# EAGLE schematic DashDial (EAGLE 9.6.2)
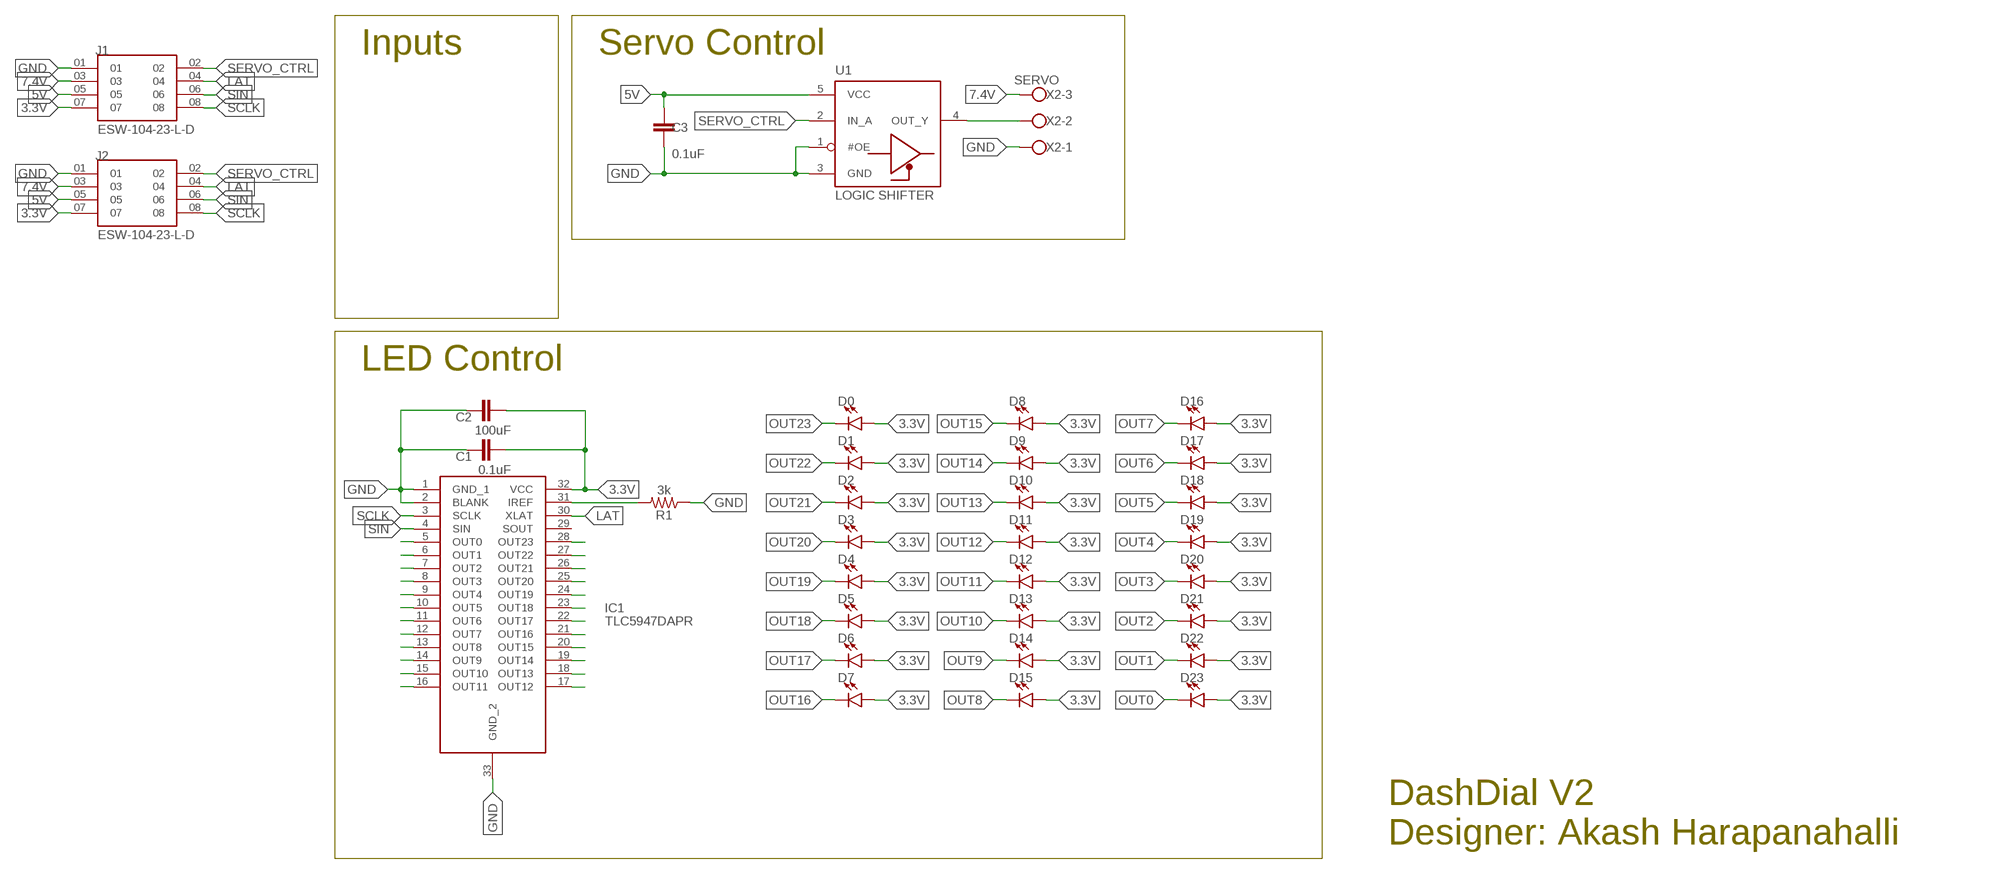
[diagram p0: schematic, sheet 1]

## Parts
C1  0.1uF  C-EUC0402  [C0402]
C2  100uF  C-EUC1206  [C1206]
C3  0.1uF  0.1UF-0603-25V-(+80/-20%)  [0603]
D0  LED3MM  [LED_3MM]
D1  LED3MM  [LED_3MM]
D2  LED3MM  [LED_3MM]
D3  LED3MM  [LED_3MM]
D4  LED3MM  [LED_3MM]
D5  LED3MM  [LED_3MM]
D6  LED3MM  [LED_3MM]
D7  LED3MM  [LED_3MM]
D8  LED3MM  [LED_3MM]
D9  LED3MM  [LED_3MM]
D10  LED3MM  [LED_3MM]
D11  LED3MM  [LED_3MM]
D12  LED3MM  [LED_3MM]
D13  LED3MM  [LED_3MM]
D14  LED3MM  [LED_3MM]
D15  LED3MM  [LED_3MM]
D16  LED3MM  [LED_3MM]
D17  LED3MM  [LED_3MM]
D18  LED3MM  [LED_3MM]
D19  LED3MM  [LED_3MM]
D20  LED3MM  [LED_3MM]
D21  LED3MM  [LED_3MM]
D22  LED3MM  [LED_3MM]
D23  LED3MM  [LED_3MM]
IC1  TLC5947DAPR  [SOP65P810X120-33N]
J1  ESW-104-23-L-D  [SAMTEC_ESW-104-23-L-D]
J2  ESW-104-23-L-D  [SAMTEC_ESW-104-23-L-D]
R1  3k  RESISTORAXIAL-0.3  [AXIAL-0.3]
U1  LOGIC SHIFTER  MC74VHC1GT125DF  [SOT353]
X2  SERVO  W237-103  [W237-103]

## Nets
3.3V: C1.2 C2.2 D0.A D1.A D2.A D3.A D4.A D5.A D6.A D7.A D8.A D9.A D10.A D11.A D12.A D13.A D14.A D15.A D16.A D17.A D18.A D19.A D20.A D21.A D22.A D23.A IC1.32(VCC) J1.07 J2.07
5V: C3.1 J1.05 J2.05 U1.5(VCC)
7.4V: J1.03 J2.03 X2.3
GND: C1.1 C2.1 C3.2 IC1.1(GND_1) IC1.2(BLANK) IC1.33(GND_2) J1.01 J2.01 R1.P$1 U1.1(#OE) U1.3(GND) X2.1
LAT: IC1.30(XLAT) J1.04 J2.04
N$1: U1.4(OUT_Y) X2.2
N$32: IC1.31(IREF) R1.P$2
OUT0: D23.K(C) IC1.5(OUT0)
OUT1: D22.K(C) IC1.6(OUT1)
OUT2: D21.K(C) IC1.7(OUT2)
OUT3: D20.K(C) IC1.8(OUT3)
OUT4: D19.K(C) IC1.9(OUT4)
OUT5: D18.K(C) IC1.10(OUT5)
OUT6: D17.K(C) IC1.11(OUT6)
OUT7: D16.K(C) IC1.12(OUT7)
OUT8: D15.K(C) IC1.13(OUT8)
OUT9: D14.K(C) IC1.14(OUT9)
OUT10: D13.K(C) IC1.15(OUT10)
OUT11: D12.K(C) IC1.16(OUT11)
OUT12: D11.K(C) IC1.17(OUT12)
OUT13: D10.K(C) IC1.18(OUT13)
OUT14: D9.K(C) IC1.19(OUT14)
OUT15: D8.K(C) IC1.20(OUT15)
OUT16: D7.K(C) IC1.21(OUT16)
OUT17: D6.K(C) IC1.22(OUT17)
OUT18: D5.K(C) IC1.23(OUT18)
OUT19: D4.K(C) IC1.24(OUT19)
OUT20: D3.K(C) IC1.25(OUT20)
OUT21: D2.K(C) IC1.26(OUT21)
OUT22: D1.K(C) IC1.27(OUT22)
OUT23: D0.K(C) IC1.28(OUT23)
SCLK: IC1.3(SCLK) J1.08 J2.08
SERVO_CTRL: J1.02 J2.02 U1.2(IN_A)
SIN: IC1.4(SIN) J1.06 J2.06
Unconnected: IC1.29(SOUT)

## Notes on the sheet
- Inputs | Servo Control
- LED Control
- DashDial V2
  Designer: Akash Harapanahalli

## Library data of the parts
C1 C2 = rcl:C-EU: CAPACITOR, European symbol; SPICEPREFIX: C
C3 = SparkFun-Capacitors:0.1UF: 0.1µF ceramic capacitors A capacitor is a passive two-terminal electrical component used to store electrical energy temporarily in an electric field.; PROD_ID: CAP-00810
D0 D1-D23 = SparkFun-LED:LED: LED (Generic) Standard schematic elements and footprints for 5mm, 3mm, 1206, and 0603 sized LEDs. Generic LEDs with no color specified.; PROD_ID: DIO-08794
IC1 = TLC5947DAPR:TLC5947DAPR: 24-Channel, 12-Bit PWM LED Driver with Internal Oscillator Source: Datasheet <https://www.arrow.com/en/products/tlc5947dapr/texas-instruments>; ARROW_PART_NUMBER: TLC5947DAPR; ARROW_PRICE-STOCK: https://www.arrow.com/en/products/tlc5947dapr/texas-instruments; DESCRIPTION: 24-Channel, 12-Bit PWM LED Driver with Internal Oscillator; HEIGHT: 1.2mm; MANUFACTURER_NAME: Texas Instruments; MANUFACTURER_PART_NUMBER: TLC5947DAPR; MOUSER_PART_NUMBER: 595-TLC5947DAPR; MOUSER_PRICE-STOCK: https://www.mouser.co.uk/ProductDetail/Texas-Instruments/TLC5947DAPR?qs=Vj8prLbzEFAFq%2FnrzWbKjQ%3D%3D
J1 J2 = ESW-104-23-L-D:ESW-104-23-L-D; MANUFACTURER: Samtec Inc.; PARTREV: R; STANDARD: Manufacturer Recommendations
R1 = SparkFun-Resistors:RESISTOR: Generic Resistor Package
U1 = MC74VHC1GT125:MC74VHC1GT125: OnSemi's MC74VHC1GT125 Noninverting Buffer / CMOS Logic Level Shifter with LSTTL-Compatible Inputs Description: The MC74VHC1GT125 is a single gate noninverting buffer fabricated with silicon gate CMOS technology. It achieves high speed operation similar to equivalent Bipolar Schottky TTL while maintaining CMOS low power dissipation. The MC74VHC1GT125 requires the 3-state control input (OE) to be set High to place the output into the high impedance state. The device input is compatible with TTL-type input thresholds and the output has a full 5 V CMOS level output swing. The input protection circuitry on this device allows overvoltage tolerance on the input, allowing the device to be used as a logic-level translator from 3.0 V CMOS logic to 5.0 V CMOS Logic or from 1.8 V CMOS logic to 3.0 V CMOS Logic while operating at the high-voltage power supply. The MC74VHC1GT125 input structure provides protection when voltages up to 7 V are applied, regardless of the supply voltage. This allows the MC74VHC1GT125 to be used to interface 5 V circuits to 3 V circuits. The output structures also provide protection when VCC = 0 V. These input and output structures help prevent device destruction caused by supply voltage - input/output voltage mismatch, battery backup, hot insertion, etc. Features: High Speed: tPD = 3.5 ns (Typ) at VCC = 5 V Low Power Dissipation: ICC = 1 A (Max) at TA = 25°C TTL-Compatible Inputs: VIL = 0.8 V; VIH = 2.0 V CMOS-Compatible Outputs: VOH > 0.8 VCC; VOL < 0.1 VCC @Load Power Down Protection Provided on Inputs and Outputs Balanced Propagation Delays Pin and Function Compatible with Other Standard Logic Families Chip Complexity: FETs = 62; Equivalent Gates = 16 Please send any comments to: messi@users.sourceforge.net; AVAILABILITY: Unavailable; DESCRIPTION: Buffer, Non-Inverting 1 Element 1 Bit per Element 3-State Output SC-88A (SC-70-5/SOT-353); MF: ON Semiconductor; MP: MC74VHC1GT125; PACKAGE: SOT-353 ON Semiconductor; PRICE: None
X2 = con-wago-500:W237-103: WAGO SCREW CLAMP; MPN: 237-103; OC_FARNELL: unknown; OC_NEWARK: 18M7116